# EasyEDA Pro project ProDoc_PCB1_2025-11-01.epro

# Board PCB1
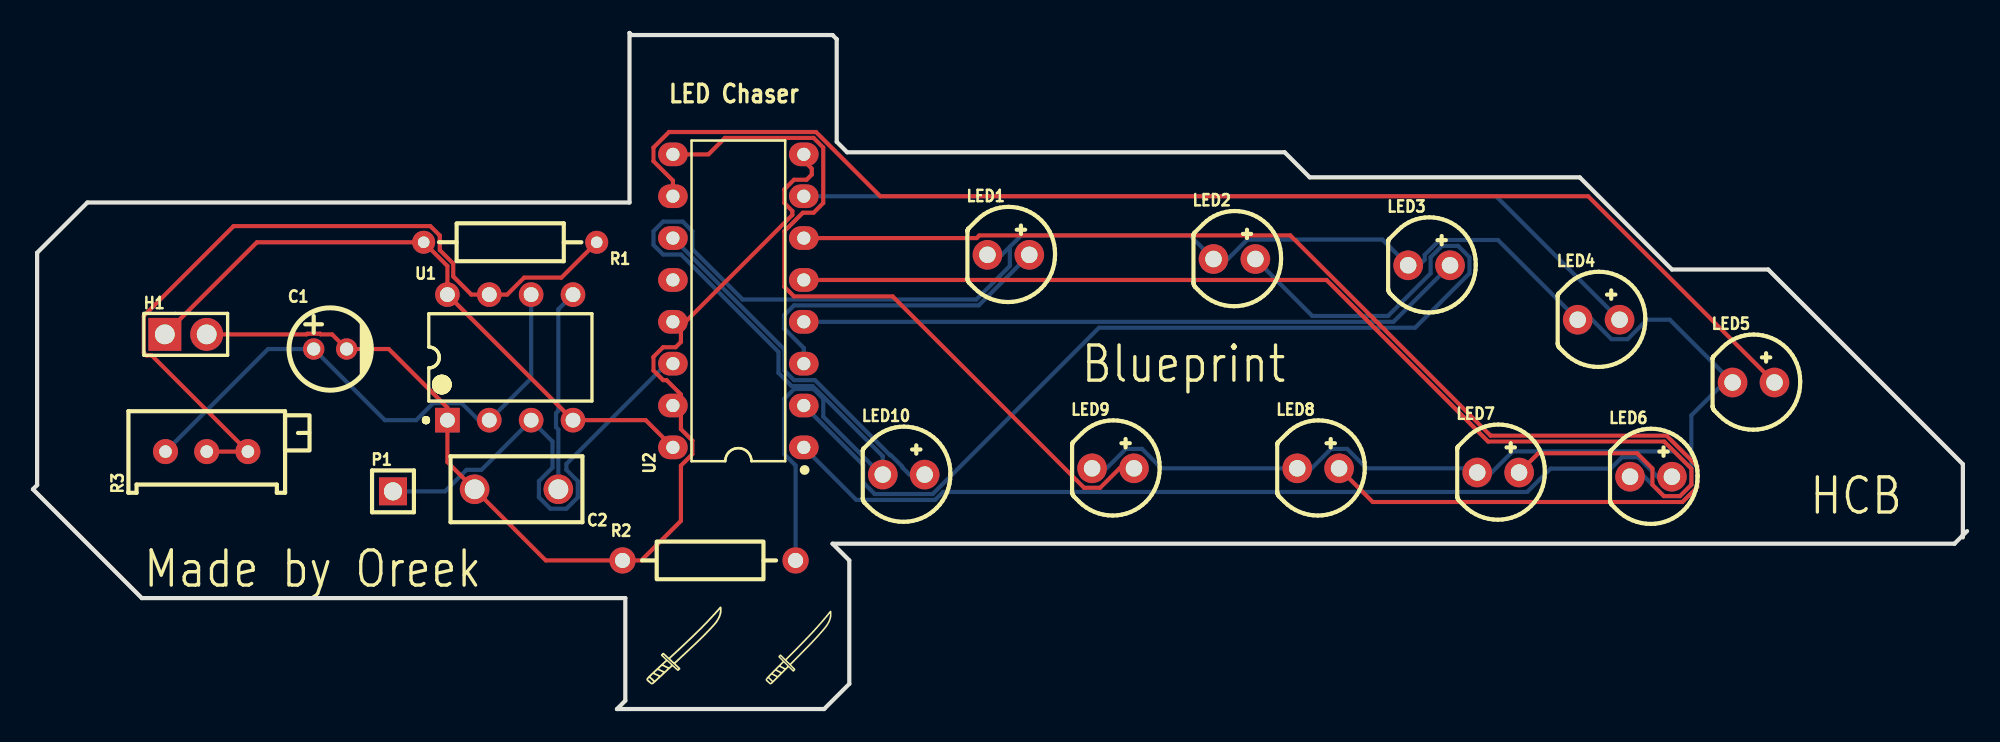
[diagram p0: board, top side]
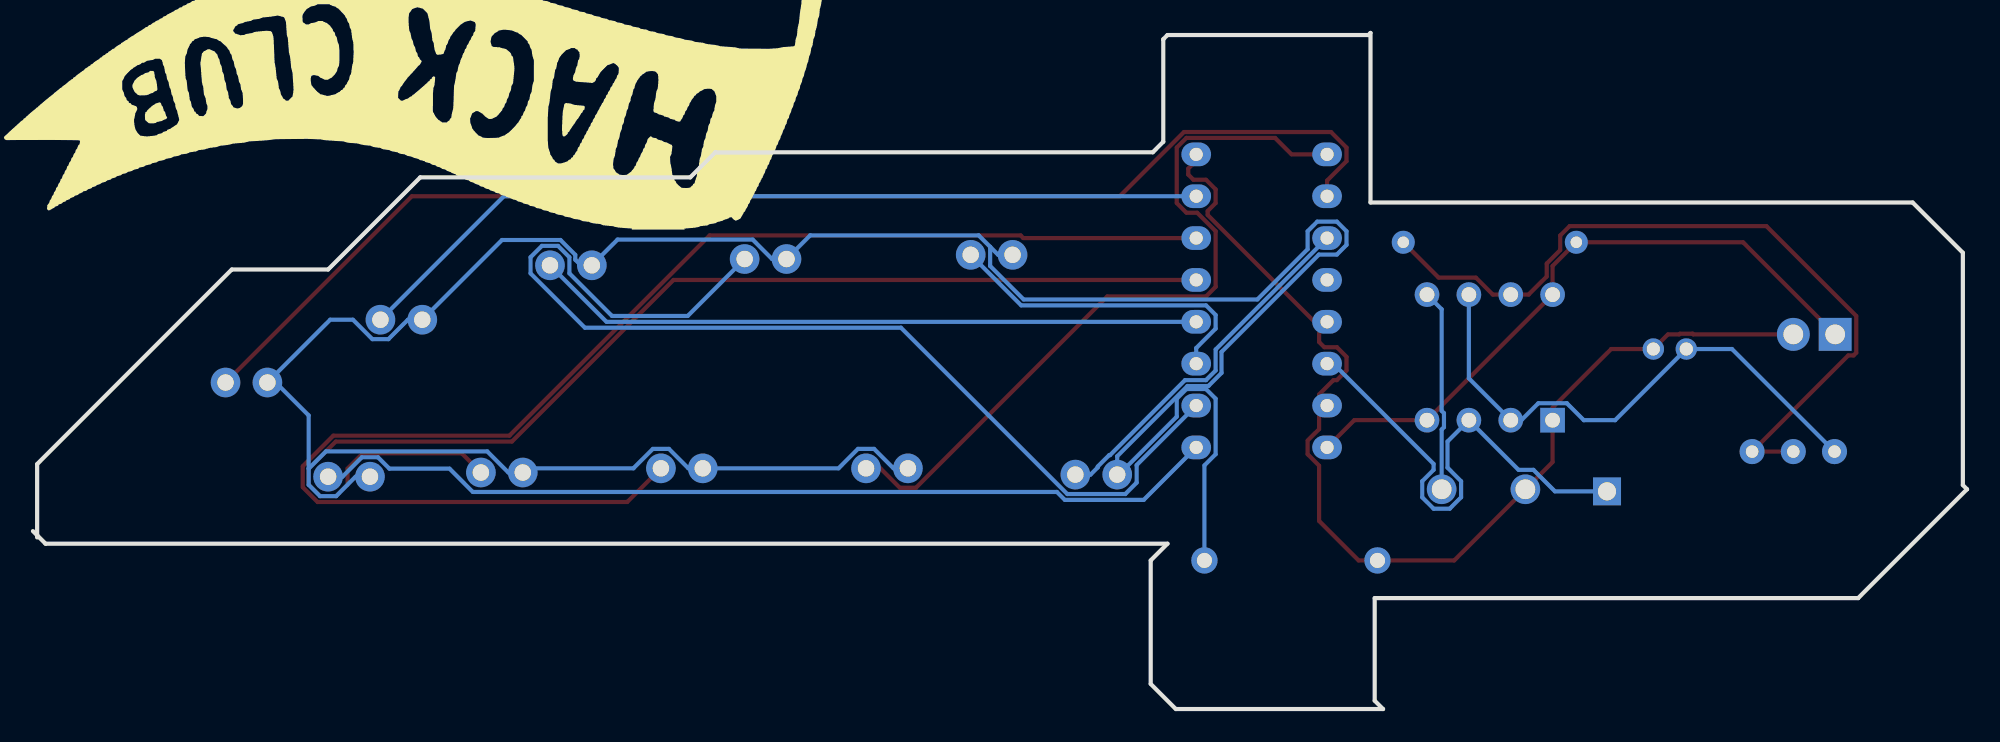
[diagram p1: board, bottom side, seen from below]

Outline 117.35 x 41.02 mm; copper layers: Top Layer, Bottom Layer. Coordinates in mm from the lower left corner of the outline.
Outline path: 117.09,10.54 116.59,10.03 48.51,10.03 49.53,9.02 49.53,1.52 48.01,0 35.43,0 35.94,0.51 35.94,6.73 6.6,6.73 0,13.33 0.25,13.59 0.25,27.69 3.3,30.73 36.2,30.73 36.2,41.02 36.32,40.89 48.51,40.89 48.77,40.64 48.77,34.42 49.4,33.78 75.95,33.78 77.47,32.26 93.85,32.26 99.44,26.67 105.28,26.67 117.09,14.86 117.09,10.54 ; 117.09,10.54 117.35,10.8 ; 117.09,10.54 117.09,10.41
Stack: Top Layer 0.035mm / Dielectric1 1.51mm FR4 er 4.5 / Bottom Layer 0.035mm

## Design rules (mm)
template: JLCPCB Capability(Two Layers Board)
spacing copperThickness1oz (default): track to track 0.102, other pairs 0.152 to 0.3
spacing copperThickness2oz: track to track 0.203, other pairs 0.152 to 0.3
track width copperThickness1oz (default): min 0.127, default 0.254, max 2.54
track width copperThickness2oz: min 0.203, default 0.254, max 2.54
differential pair differentialPair (default): width min 0.127, default 0.254, max 2.54; gap min 0.152, default 0.152
via viaSize (default): diameter min 0.5, default 0.61, max 10; hole min 0.3, default 0.305, max 6.3

## Placement (name value [footprint] x y rotation side)
C1  1uF  [CAP-TH_BD5.0-P2.00-D0.8-FD]  18.03 21.84 0 top
C2  10nF  [CAP-TH_L8.0-W4.0-P5.00-D1.2]  29.34 13.33 180 top
H1  PZ254V-11-02P  [HDR-TH_2P-P2.54-V-M]  9.27 22.73 0 top
LED1  XL-502UWC  [LED-TH_BD5.9-P2.54-RD_WHITE]  59.18 27.56 0 top
LED2  XL-502UWC  [LED-TH_BD5.9-P2.54-RD_WHITE]  72.9 27.3 0 top
LED3  XL-502UWC  [LED-TH_BD5.9-P2.54-RD_WHITE]  84.71 26.92 0 top
LED4  XL-502UWC  [LED-TH_BD5.9-P2.54-RD_WHITE]  95 23.62 0 top
LED5  XL-502UWC  [LED-TH_BD5.9-P2.54-RD_WHITE]  104.39 19.81 0 top
LED6  XL-502UWC  [LED-TH_BD5.9-P2.54-RD_WHITE]  98.17 14.1 0 top
LED7  XL-502UWC  [LED-TH_BD5.9-P2.54-RD_WHITE]  88.9 14.35 0 top
LED8  XL-502UWC  [LED-TH_BD5.9-P2.54-RD_WHITE]  77.98 14.61 0 top
LED9  XL-502UWC  [LED-TH_BD5.9-P2.54-RD_WHITE]  65.53 14.61 0 top
LED10  XL-502UWC  [LED-TH_BD5.9-P2.54-RD_WHITE]  52.83 14.22 0 top
P1  2.54-1*1P针  [HDR-TH_1P-P2.54-V-M]  21.84 13.21 0 top
R1  1kΩ  [RES-TH_BD2.3-L6.5-P10.50-D0.5]  28.96 28.32 180 top
R2  470Ω  [RES-TH_BD2.2-L6.5-P10.50-D0.6]  41.02 9.02 0 top
R3  50kΩ  [RES-ADJ-TH_3P-L9.5-W4.85-P2.50-BL-L]  10.54 15.62 90 top
U1  NE555P  [DIP-8_L9.8-W6.6-P2.54-LS7.6-BL]  28.96 21.34 0 top
U2  CD4017BE(LX)  [PDIP-16_L19.3-W6.4-P2.54-LS7.94-BL]  42.8 24.77 90 top

## Footprints (pads in the part's own frame, mm; a bottom-side part is the same pattern mirrored in y, then rotated)
CAP-TH_BD5.0-P2.00-D0.8-FD
  round 1.3 hole 0.8: 1(-1,0) 2(1,0)
CAP-TH_L8.0-W4.0-P5.00-D1.2
  round 1.8 hole 1.2: 1(-2.54,0) 2(2.54,0)
DIP-8_L9.8-W6.6-P2.54-LS7.6-BL
  rect 1.5x1.5 hole 0.9: 1(-3.81,-3.81)
  round 1.5 hole 0.9: 2(-1.27,-3.81) 3(1.27,-3.81) 4(3.81,-3.81) 5(3.81,3.81) 6(1.27,3.81) 7(-1.27,3.81) 8(-3.81,3.81)
HDR-TH_1P-P2.54-V-M
  rect 1.7x1.7 hole 1.1: 1(0,0)
HDR-TH_2P-P2.54-V-M
  rect 2x2 hole 1.2: 1(-1.27,0)
  round 2 hole 1.2: 2(1.27,0)
LED-TH_BD5.9-P2.54-RD_WHITE
  round 1.8 hole 1: 1(-1.27,0) 2(1.27,0)
PDIP-16_L19.3-W6.4-P2.54-LS7.94-BL
  oval 1.44x1.8 hole 0.8: 1(-8.89,-3.97) 2(-6.35,-3.97) 3(-3.81,-3.97) 4(-1.27,-3.97) 5(1.27,-3.97) 6(3.81,-3.97) 7(6.35,-3.97) 8(8.89,-3.97) 9(8.89,3.97) 10(6.35,3.97) 11(3.81,3.97) 12(1.27,3.97) 13(-1.27,3.97) 14(-3.81,3.97) 15(-6.35,3.97) 16(-8.89,3.97)
RES-ADJ-TH_3P-L9.5-W4.85-P2.50-BL-L
  round 1.524 hole 0.762: 1(0,2.5) 2(0,0) 3(0,-2.5)
RES-TH_BD2.2-L6.5-P10.50-D0.6
  round 1.6 hole 0.914: 1(-5.25,0) 2(5.25,0)
RES-TH_BD2.3-L6.5-P10.50-D0.5
  round 1.4 hole 0.7: 1(-5.25,0) 2(5.25,0)

## Nets
$1N1408: H1.1 R1.2 U1.4 U1.8 U2.16
$1N1413: C1.2 C2.2 H1.2 R2.1 U1.1 U2.8 U2.13 U2.15
$1N1524: C1.1 R3.1 U1.2 U1.6
$1N1586: R1.1 R3.2 R3.3 U1.7
$1N1636: C2.1 U1.5
$1N1663: P1.1 U1.3 U2.14
$1N1881: LED1.1 LED2.1 LED3.1 LED4.1 LED5.1 LED6.1 LED7.1 LED8.1 LED9.1 LED10.1 R2.2
$1N2147: LED1.2 U2.3
$1N2156: LED2.2 U2.2
$1N2162: LED3.2 U2.4
$1N2169: LED4.2 U2.7
$1N2176: LED5.2 U2.10
$1N2183: LED6.2 U2.1
$1N2190: LED7.2 U2.5
$1N2196: LED8.2 U2.6
$1N2203: LED9.2 U2.9
$1N2218: LED10.2 U2.11

Pads without a net: U2 12

## Routing (per net, layer and track width the routed paths; a pad name or vN(x,y) marks a point on that pad's centre or on a via; arc(x,y) is an arc through that point)
$1N1408: length 39.3
  Top Layer w0.254: H1.1 13.59,28.32 R1.2 25.15,26.88 U1.8 U1.4 37.18,17.53 U2.16
$1N1413: length 66.7
  Top Layer w0.254: H1.2 16.61,22.73 16.65,22.77 17.42,22.77 17.46,22.73 18.14,22.73 C1.2 21.59,21.84 25.15,18.29 U1.1 25.15,14.99 C2.2 31.11,9.02 R2.1 36.91,9.02 39.31,11.42 39.31,14.77 40.01,15.46 40.01,16.29 39.31,16.98 39.31,19.08 38.44,19.96 38.24,19.96 37.65,20.54 37.65,21.37 38.24,21.95 39,21.95 39.31,22.27 39.31,23.22 46.07,29.98 46.07,30.22 45.59,30.7 45.59,31.53 46.18,32.11 46.94,32.11 47.25,32.43 47.25,32.79 46.39,33.66
$1N1524: length 33.5
  Bottom Layer w0.254: R3.1 14.26,21.84 C1.1 21.35,17.53 23.25,17.53 24.28,18.55 26.01,18.55 27.04,17.53 U1.2 30.23,20.07 U1.6
$1N1586: length 47.3
  Top Layer w0.254: R3.2 R3.3 7.21,21.45 6.89,21.45 6.72,21.62 6.72,23.85 12.17,29.3 24.11,29.3 24.69,28.73 24.69,27.85 25.5,27.03 25.5,26.25 26.6,25.15 U1.7 28.77,25.15 29.8,26.17 32.06,26.17 R1.1
$1N1636: length 12.3
  Bottom Layer w0.254: C2.1 31.88,16.96 31.74,17.1 31.74,17.95 31.88,18.09 31.88,24.26 U1.5
$1N1663: length 29.6
  Bottom Layer w0.254: 38.45,20.95 32.37,14.87 32.37,14.51 33.06,13.82 33.06,12.85 32.37,12.16 31.39,12.16 30.7,12.85 30.7,13.82 31.52,14.65 31.52,16.23 U1.3 27.21,14.51 26.31,14.51 25,13.21 P1.1
$1N1881: length 171.7
  Bottom Layer w0.254: 59.27,28.05 59.96,28.74 70.19,28.74 LED2.1 72.5,27.3 73.68,28.48 81.88,28.48 LED3.1 84.1,26.92 84.44,27.27 84.44,27.56 85.34,28.46 88.89,28.46 LED4.1 94.6,23.62 95.78,22.44 96.75,22.44 97.93,23.62 99.31,23.62 LED5.1 102.62,19.81 100.62,17.82 100.62,14.59 ; 59.27,28.05 59.27,26.88 57.24,24.85 43.06,24.85 40.01,27.9 40.01,28.99 39.42,29.57 38.24,29.57 37.65,28.99 37.65,28.16 38.24,27.58 39.32,27.58 45.23,21.67 45.23,20.39 46.03,19.6 47.3,19.6 51.56,15.34 51.56,14.22 51.46,14.22 47.95,17.74 47.95,18.83 47.36,19.41 46.18,19.41 45.59,18.83 45.59,15.46 46.27,14.78 R2.2 ; 59.27,28.05 58.78,27.56 LED1.1 ; 100.62,14.59 99.57,15.63 89.78,15.63 88.5,14.35 LED7.1 87.38,14.61 80.92,14.61 79.74,15.78 78.76,15.78 77.58,14.61 LED8.1 68.47,14.61 67.29,15.78 66.31,15.78 65.13,14.61 LED9.1 ; 100.62,14.59 100.62,13.61 99.93,12.92 98.95,12.92 97.77,14.1 LED6.1
$1N2147: length 19.8
  Bottom Layer w0.254: U2.3 46.77,21.9 45.59,23.08 45.59,23.91 46.18,24.49 57.39,24.49 LED1.2
$1N2156: length 66.8
  Bottom Layer w0.254: U2.2 50.38,14.8 50.38,13.74 51.07,13.05 54.59,13.05 64.68,23.14 83.86,23.14 87.16,26.44 87.16,27.41 86.47,28.1 85.49,28.1 84.8,27.41 84.8,26.44 82.22,23.85 77.62,23.85 LED2.2
$1N2162: length 40.6
  Bottom Layer w0.254: LED3.2 82.55,23.5 U2.4
$1N2169: length 52.6
  Bottom Layer w0.254: LED4.2 88.77,31.11 U2.7
$1N2176: length 78.1
  Top Layer w0.254: U2.10 38.83,32.06 37.65,33.24 37.65,34.07 38.59,35.01 47.51,35.01 51.41,31.11 94.36,31.11 LED5.2
$1N2183: length 55.6
  Bottom Layer w0.254: LED6.2 98.57,14.1 97.39,15.28 96.41,15.28 95.72,14.59 92.07,14.59 90.66,13.17 55.22,13.17 54.74,12.69 49.96,12.69 U2.1
$1N2190: length 72.4
  Top Layer w0.254: U2.5 78.49,26.03 88.29,16.23 98.97,16.23 100.62,14.59 100.62,13.61 99.93,12.92 98.95,12.92 98.26,13.61 98.26,14.59 97.33,15.52 91.34,15.52 LED7.2
$1N2196: length 84.3
  Top Layer w0.254: 79.25,14.61 81.29,12.56 100.08,12.56 100.98,13.46 100.98,14.73 99.12,16.59 88.44,16.59 76.29,28.74 57.42,28.74 57.26,28.58 U2.6
$1N2203: length 46.3
  Top Layer w0.254: U2.9 40.98,33.66 41.98,34.65 47.36,34.65 47.95,34.07 47.95,30.7 47.36,30.12 46.72,30.12 45.59,28.99 45.59,25.62 46.18,25.04 52.16,25.04 63.77,13.43 64.75,13.43 65.93,14.61 LED9.2
$1N2218: length 22
  Bottom Layer w0.254: LED10.2 53.18,14.22 52.74,14.66 52.74,14.71 52.05,15.4 52,15.4 47.45,19.96 46.18,19.96 45.59,20.54 45.59,21.81 U2.11

## Text on the board
Top Silkscreen Layer: LED Chaser | Made by Oreek | Blueprint | HCB
